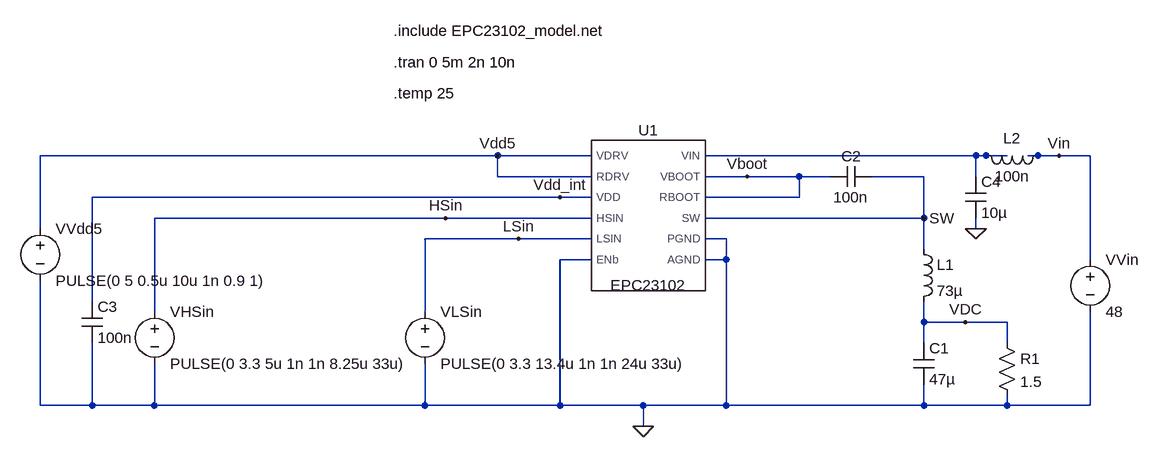
[diagram p0: schematic EPC23102_sim.asc]
EPC23102_sim.asc, the LTspice schematic file:
Version 4.1
SHEET 1 1808 680
WIRE 672 -128 -32 -128
WIRE 816 -128 672 -128
WIRE 1408 -128 992 -128
WIRE 1424 -128 1408 -128
WIRE 1456 -128 1424 -128
WIRE 1504 -128 1488 -128
WIRE 1536 -128 1504 -128
WIRE 1584 -128 1536 -128
WIRE 672 -96 672 -128
WIRE 816 -96 672 -96
WIRE 1056 -96 992 -96
WIRE 1136 -96 1056 -96
WIRE 1184 -96 1136 -96
WIRE 1328 -96 1248 -96
WIRE 1408 -96 1408 -128
WIRE 768 -64 48 -64
WIRE 816 -64 768 -64
WIRE 1136 -64 1136 -96
WIRE 1136 -64 992 -64
WIRE 592 -32 144 -32
WIRE 816 -32 592 -32
WIRE 1328 -32 1328 -96
WIRE 1328 -32 992 -32
WIRE -32 -16 -32 -128
WIRE 1408 -16 1408 -32
WIRE 704 0 560 0
WIRE 816 0 704 0
WIRE 1024 0 992 0
WIRE 1328 16 1328 -32
WIRE 816 32 768 32
WIRE 1024 32 1024 0
WIRE 1024 32 992 32
WIRE 1584 32 1584 -128
WIRE 48 96 48 -64
WIRE 144 112 144 -32
WIRE 560 112 560 0
WIRE 1328 128 1328 96
WIRE 1392 128 1328 128
WIRE 1456 128 1392 128
WIRE 1328 160 1328 128
WIRE 1456 160 1456 128
WIRE -32 256 -32 64
WIRE 48 256 48 160
WIRE 48 256 -32 256
WIRE 144 256 144 192
WIRE 144 256 48 256
WIRE 560 256 560 192
WIRE 560 256 144 256
WIRE 768 256 768 32
WIRE 768 256 560 256
WIRE 896 256 768 256
WIRE 1024 256 1024 32
WIRE 1024 256 896 256
WIRE 1328 256 1328 224
WIRE 1328 256 1024 256
WIRE 1456 256 1456 240
WIRE 1456 256 1328 256
WIRE 1584 256 1584 112
WIRE 1584 256 1456 256
WIRE 896 288 896 256
FLAG 896 288 0
FLAG 1392 128 VDC
FLAG 592 -32 HSin
FLAG 704 0 LSin
FLAG 672 -128 Vdd5
FLAG 1536 -128 Vin
FLAG 1056 -96 Vboot
FLAG 1328 -32 SW
FLAG 768 -64 Vdd_int
FLAG 1408 -16 0
SYMBOL voltage 144 96 R0
WINDOW 123 0 0 Left 0
WINDOW 39 0 0 Left 0
SYMATTR InstName VHSin
SYMATTR Value PULSE(0 3.3 5u 1n 1n 8.25u 33u)
SYMBOL voltage 560 96 R0
WINDOW 123 0 0 Left 0
WINDOW 39 0 0 Left 0
SYMATTR InstName VLSin
SYMATTR Value PULSE(0 3.3 13.4u 1n 1n 24u 33u)
SYMBOL ind 1312 0 R0
SYMATTR InstName L1
SYMATTR Value 73µ
SYMATTR SpiceLine Ipk=25.6 Rser=0.0082 Rpar=0 Cpar=0
SYMBOL res 1440 144 R0
SYMATTR InstName R1
SYMATTR Value 1.5
SYMBOL cap 1312 160 R0
SYMATTR InstName C1
SYMATTR Value 47µ
SYMBOL cap 1248 -112 R90
WINDOW 0 0 32 VBottom 2
WINDOW 3 32 32 VTop 2
SYMATTR InstName C2
SYMATTR Value 100n
SYMBOL voltage -32 -32 R0
WINDOW 123 0 0 Left 0
WINDOW 39 0 0 Left 0
SYMATTR InstName VVdd5
SYMATTR Value PULSE(0 5 0.5u 10u 1n 0.9 1)
SYMBOL voltage 1584 16 R0
WINDOW 123 0 0 Left 0
WINDOW 39 0 0 Left 0
SYMATTR InstName VVin
SYMATTR Value 48
SYMBOL EPC23102_model 896 -48 R0
SYMATTR InstName U1
SYMBOL cap 32 96 R0
SYMATTR InstName C3
SYMATTR Value 100n
SYMBOL cap 1392 -96 R0
SYMATTR InstName C4
SYMATTR Value 10µ
SYMATTR SpiceLine Rser=1m
SYMBOL ind 1520 -144 R90
WINDOW 0 5 56 VBottom 2
WINDOW 3 32 56 VTop 2
SYMATTR InstName L2
SYMATTR Value 100n
SYMATTR SpiceLine Rser=10m
TEXT 512 -272 Left 2 !.tran 0 5m 2n 10n
TEXT 512 -224 Left 2 !.temp 25
TEXT 512 -320 Left 2 !.include EPC23102_model.net

The netlist it stands for:
* EPC23102_sim.asc
VHSin HSin 0 PULSE(0 3.3 5u 1n 1n 8.25u 33u)
VLSin LSin 0 PULSE(0 3.3 13.4u 1n 1n 24u 33u)
L1 SW VDC 73µ Ipk=25.6 Rser=0.0082 Rpar=0 Cpar=0
R1 VDC 0 1.5
C1 VDC 0 47µ
C2 SW Vboot 100n
VVdd5 Vdd5 0 PULSE(0 5 0.5u 10u 1n 0.9 1)
VVin Vin 0 48
X§U1 0 HSin LSin Vdd5 0 0 Vboot Vdd5 SW Vboot Vdd_int N001 EPC23102  ; pins ENb HSIN LSIN VDRV AGND PGND RBOOT RDRV SW VBOOT VDD VIN
C3 Vdd_int 0 100n
C4 N001 0 10µ Rser=1m
L2 Vin N001 100n Rser=10m
.tran 0 5m 2n 10n
.temp 25
.include EPC23102_model.net
.lib EPC23102_model.net
.backanno
.end